# EAGLE design cv_led2 (EAGLE 8.5.2)
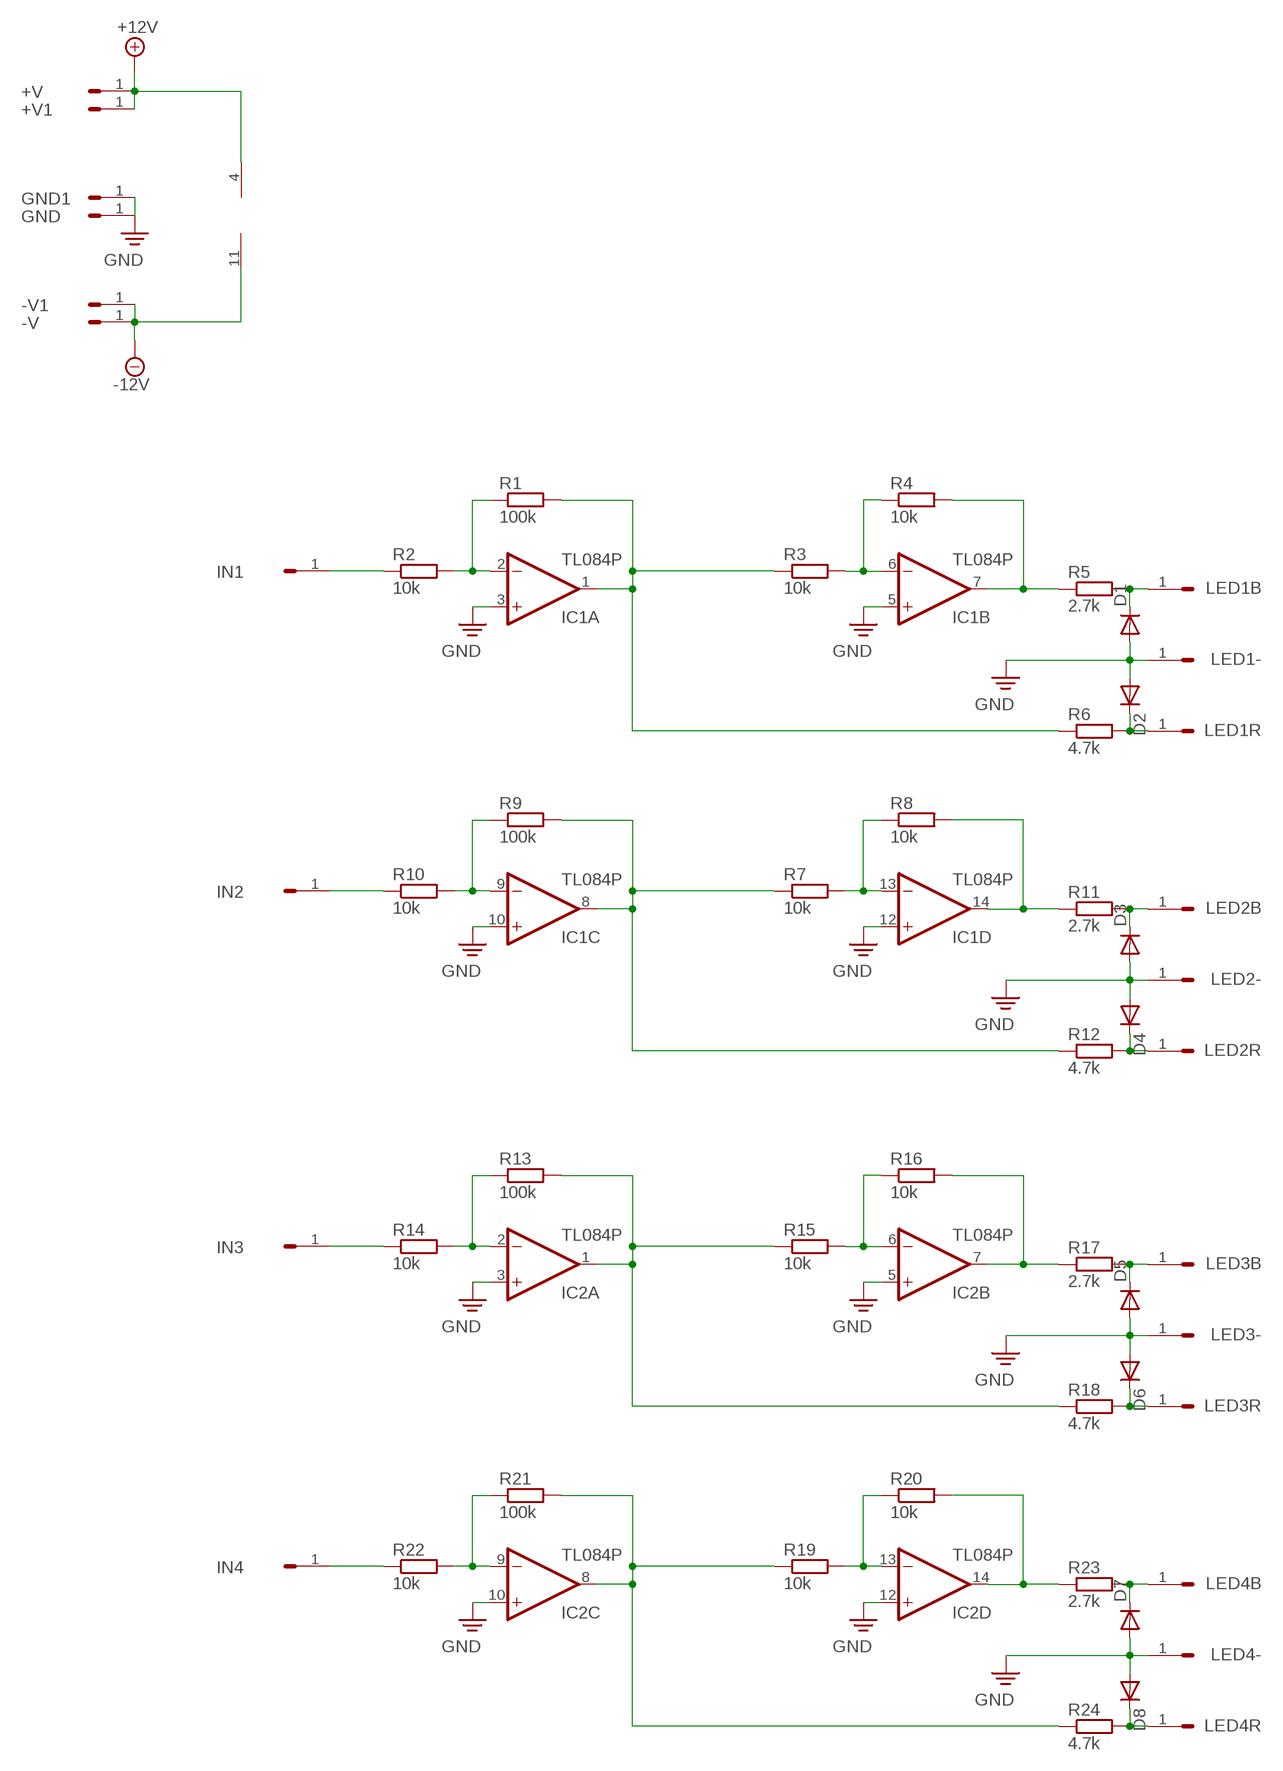
[diagram p0: schematic, sheet 1]

## Parts
+V  HEADER/MALE/01  [HEADER/MALE/01]
+V1  HEADER/MALE/01  [HEADER/MALE/01]
-V  HEADER/MALE/01  [HEADER/MALE/01]
-V1  HEADER/MALE/01  [HEADER/MALE/01]
D1  1N4148DO35-7  [DO35-7]
D2  1N4148DO35-7  [DO35-7]
D3  1N4148DO35-7  [DO35-7]
D4  1N4148DO35-7  [DO35-7]
D5  1N4148DO35-7  [DO35-7]
D6  1N4148DO35-7  [DO35-7]
D7  1N4148DO35-7  [DO35-7]
D8  1N4148DO35-7  [DO35-7]
GND  HEADER/MALE/01  [HEADER/MALE/01]
GND1  HEADER/MALE/01  [HEADER/MALE/01]
IC1  TL084P  [DIL14]
IC2  TL084P  [DIL14]
IN1  HEADER/MALE/01  [HEADER/MALE/01]
IN2  HEADER/MALE/01  [HEADER/MALE/01]
IN3  HEADER/MALE/01  [HEADER/MALE/01]
IN4  HEADER/MALE/01  [HEADER/MALE/01]
LED1-  HEADER/MALE/01  [HEADER/MALE/01]
LED1B  HEADER/MALE/01  [HEADER/MALE/01]
LED1R  HEADER/MALE/01  [HEADER/MALE/01]
LED2-  HEADER/MALE/01  [HEADER/MALE/01]
LED2B  HEADER/MALE/01  [HEADER/MALE/01]
LED2R  HEADER/MALE/01  [HEADER/MALE/01]
LED3-  HEADER/MALE/01  [HEADER/MALE/01]
LED3B  HEADER/MALE/01  [HEADER/MALE/01]
LED3R  HEADER/MALE/01  [HEADER/MALE/01]
LED4-  HEADER/MALE/01  [HEADER/MALE/01]
LED4B  HEADER/MALE/01  [HEADER/MALE/01]
LED4R  HEADER/MALE/01  [HEADER/MALE/01]
R1  100k  RESISTORRESISTOR/UPRIGHT/7.5  [RESISTOR/7.5]
R2  10k  RESISTORRESISTOR/UPRIGHT/7.5  [RESISTOR/7.5]
R3  10k  RESISTORRESISTOR/UPRIGHT/7.5  [RESISTOR/7.5]
R4  10k  RESISTORRESISTOR/UPRIGHT/7.5  [RESISTOR/7.5]
R5  2.7k  RESISTORRESISTOR/UPRIGHT/7.5  [RESISTOR/7.5]
R6  4.7k  RESISTORRESISTOR/UPRIGHT/7.5  [RESISTOR/7.5]
R7  10k  RESISTORRESISTOR/UPRIGHT/7.5  [RESISTOR/7.5]
R8  10k  RESISTORRESISTOR/UPRIGHT/7.5  [RESISTOR/7.5]
R9  100k  RESISTORRESISTOR/UPRIGHT/7.5  [RESISTOR/7.5]
R10  10k  RESISTORRESISTOR/UPRIGHT/7.5  [RESISTOR/7.5]
R11  2.7k  RESISTORRESISTOR/UPRIGHT/7.5  [RESISTOR/7.5]
R12  4.7k  RESISTORRESISTOR/UPRIGHT/7.5  [RESISTOR/7.5]
R13  100k  RESISTORRESISTOR/UPRIGHT/7.5  [RESISTOR/7.5]
R14  10k  RESISTORRESISTOR/UPRIGHT/7.5  [RESISTOR/7.5]
R15  10k  RESISTORRESISTOR/UPRIGHT/7.5  [RESISTOR/7.5]
R16  10k  RESISTORRESISTOR/UPRIGHT/7.5  [RESISTOR/7.5]
R17  2.7k  RESISTORRESISTOR/UPRIGHT/7.5  [RESISTOR/7.5]
R18  4.7k  RESISTORRESISTOR/UPRIGHT/7.5  [RESISTOR/7.5]
R19  10k  RESISTORRESISTOR/UPRIGHT/7.5  [RESISTOR/7.5]
R20  10k  RESISTORRESISTOR/UPRIGHT/7.5  [RESISTOR/7.5]
R21  100k  RESISTORRESISTOR/UPRIGHT/7.5  [RESISTOR/7.5]
R22  10k  RESISTORRESISTOR/UPRIGHT/7.5  [RESISTOR/7.5]
R23  2.7k  RESISTORRESISTOR/UPRIGHT/7.5  [RESISTOR/7.5]
R24  4.7k  RESISTORRESISTOR/UPRIGHT/7.5  [RESISTOR/7.5]

## Nets
+12V: +V1.1 +V.1 IC1.4(P:V+)
-12V: -V1.1 -V.1 IC1.11(P:V-)
GND: D1.A D2.A D3.A D4.A D5.A D6.A D7.A D8.A GND1.1 GND.1 IC1.3(A:+IN) IC1.5(B:+IN) IC1.10(C:+IN) IC1.12(D:+IN) IC2.3(A:+IN) IC2.5(B:+IN) IC2.10(C:+IN) IC2.12(D:+IN) LED1-.1 LED2-.1 LED3-.1 LED4-.1
N$1: IC1.6(B:-IN) R3.2 R4.1
N$2: IC1.2(A:-IN) R1.1 R2.2
N$3: IC1.1(A:OUT) R1.2 R3.1 R6.1
N$4: IN1.1 R2.1
N$5: IC1.7(B:OUT) R4.2 R5.1
N$6: D1.C LED1B.1 R5.2
N$7: D2.C LED1R.1 R6.2
N$8: IC1.13(D:-IN) R7.2 R8.1
N$9: IC1.9(C:-IN) R9.1 R10.2
N$10: IN2.1 R10.1
N$11: IC1.14(D:OUT) R8.2 R11.1
N$12: IC1.8(C:OUT) R7.1 R9.2 R12.1
N$13: IC2.2(A:-IN) R13.1 R14.2
N$14: D3.C LED2B.1 R11.2
N$15: D4.C LED2R.1 R12.2
N$16: IC2.1(A:OUT) R13.2 R15.1 R18.1
N$17: IC2.6(B:-IN) R15.2 R16.1
N$18: IN3.1 R14.1
N$19: IC2.7(B:OUT) R16.2 R17.1
N$20: D5.C LED3B.1 R17.2
N$21: D6.C LED3R.1 R18.2
N$22: IC2.13(D:-IN) R19.2 R20.1
N$23: IC2.9(C:-IN) R21.1 R22.2
N$24: IC2.14(D:OUT) R20.2 R23.1
N$25: IC2.8(C:OUT) R19.1 R21.2 R24.1
N$26: D7.C LED4B.1 R23.2
N$27: D8.C LED4R.1 R24.2
N$28: IN4.1 R22.1

## Power pins joined to a net without a drawn wire
V+: IC2.4(P:V+)
V-: IC2.11(P:V-)

## Library data of the parts
+V +V1 -V -V1 GND GND1 IN1-IN4 LED1- LED1B LED1R LED2- LED2B LED2R LED3- LED3B LED3R LED4- LED4B LED4R = connectors:HEADER/MALE/01; SPICEPREFIX: X
D1-D8 = transistors:1N4148: DIODE high speed (Philips)
IC1 IC2 = ic_analogue:TL084: OP AMP
R1-R24 = resistors:RESISTOR: RESISTOR, European symbol

## Board
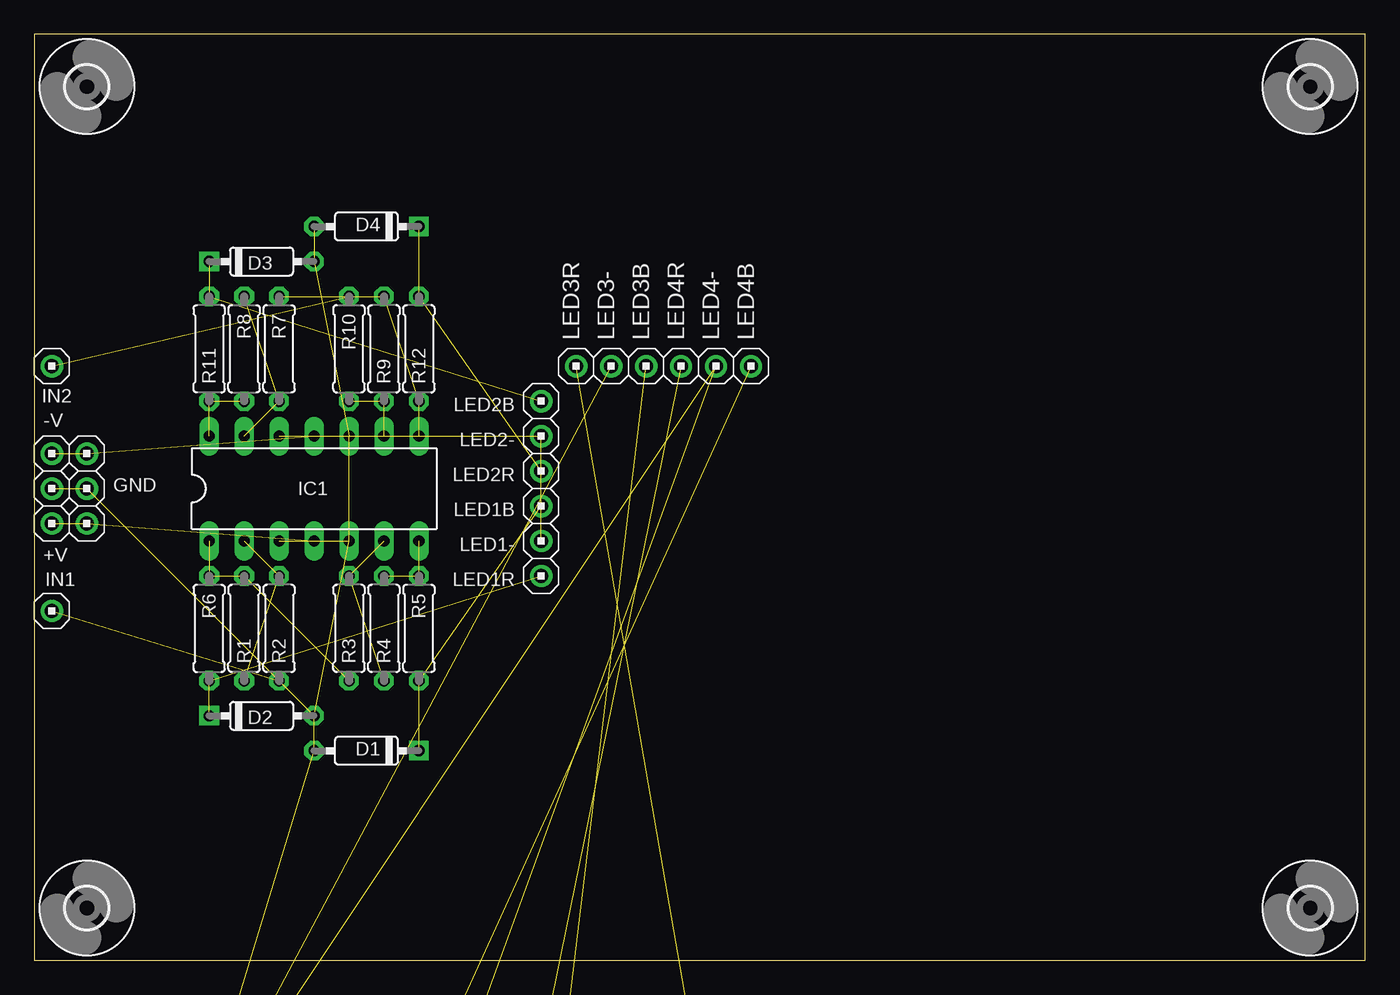
[diagram p1: board, top side]
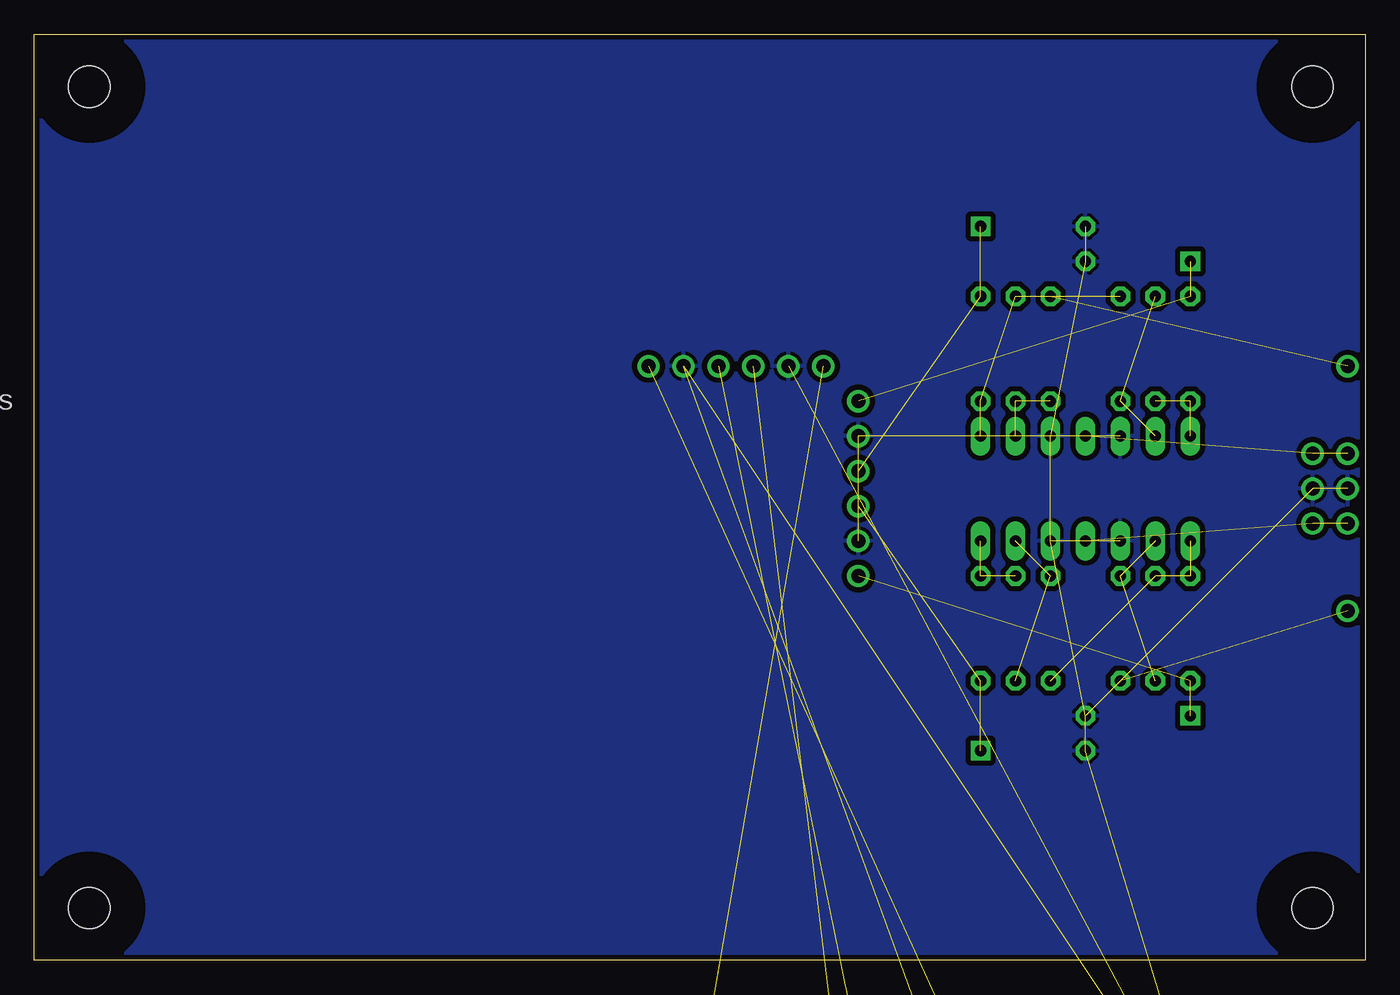
[diagram p2: board, bottom side, seen from below]

Size 96.7 x 67.3 mm. Coordinates in mm from the lower left corner, seen from the top.
Outline: 0,0 96.7,0 96.7,67.3 0,67.3 0,0
Copper layers (1*16): Top 0.0356mm / dielectric 1.5011mm / Bottom 0.0356mm
Design rules "pigatron": minimum track width 12mil, minimum drill 13mil, track to track 15mil, track to pad 10mil, pad to pad 10mil, via to via 10mil, smd to smd 6mil, copper to edge 15mil, drill to drill 10mil, minimum pad ring 12mil, minimum via ring 10mil, stop-mask expansion 4mil, vias tented up to drill 0mil, thermal gap 10mil

### Footprints (pad centres in the part's own frame; a part is rotated, then mirrored left to right if it is on the bottom)
HEADER/MALE/01 = drill 1.016: 1 0,0
DO35-7 = drill 0.813 octagon: A 3.81,0 | drill 0.813 square: C -3.81,0
DIL14 = drill 0.813 long: 1 -7.62,-3.81; 2 -5.08,-3.81; 3 -2.54,-3.81; 4 0,-3.81; 5 2.54,-3.81; 6 5.08,-3.81; 7 7.62,-3.81; 8 7.62,3.81; 9 5.08,3.81; 10 2.54,3.81; 11 0,3.81; 12 -2.54,3.81; 13 -5.08,3.81; 14 -7.62,3.81
RESISTOR/7.5 = drill 0.813 octagon: 1 -3.81,0; 2 3.81,0
STANDOFF/3.0 = hole 3: 0,0

### Placement (x,y rotation side)
+V  1.27,31.75 0 top
+V1  3.81,31.75 0 top
-V  1.27,36.83 0 top
-V1  3.81,36.83 0 top
D1  24.13,15.24 180 top
D2  16.51,17.78 0 top
D3  16.51,50.8 0 top
D4  24.13,53.34 180 top
D5  36.83,-52.07 0 top  (outside the outline)
D6  59.69,-52.07 0 top  (outside the outline)
D7  5.08,-68.58 0 top  (outside the outline)
D8  27.94,-68.58 0 top  (outside the outline)
GND  1.27,34.29 0 top
GND1  3.81,34.29 0 top
IC1  20.32,34.29 0 top
IC2  8.89,-17.78 0 top  (outside the outline)
IN1  1.27,25.4 0 top
IN2  1.27,43.18 0 top
IN3  54.61,-36.83 0 top  (outside the outline)
IN4  71.12,-36.83 0 top  (outside the outline)
LED1-  36.83,30.48 180 top
LED1B  36.83,33.02 180 top
LED1R  36.83,27.94 180 top
LED2-  36.83,38.1 180 top
LED2B  36.83,40.64 180 top
LED2R  36.83,35.56 180 top
LED3-  41.91,43.18 90 top
LED3B  44.45,43.18 90 top
LED3R  39.37,43.18 90 top
LED4-  49.53,43.18 90 top
LED4B  52.07,43.18 90 top
LED4R  46.99,43.18 90 top
R1  15.24,24.13 90 top
R2  17.78,24.13 90 top
R3  22.86,24.13 90 top
R4  25.4,24.13 90 top
R5  27.94,24.13 270 top
R6  12.7,24.13 270 top
R7  17.78,44.45 270 top
R8  15.24,44.45 270 top
R9  25.4,44.45 90 top
R10  22.86,44.45 270 top
R11  12.7,44.45 90 top
R12  27.94,44.45 90 top
R13  50.8,-68.58 0 top  (outside the outline)
R14  73.66,-68.58 0 top  (outside the outline)
R15  5.08,-83.82 0 top  (outside the outline)
R16  27.94,-83.82 0 top  (outside the outline)
R17  50.8,-83.82 0 top  (outside the outline)
R18  73.66,-83.82 0 top  (outside the outline)
R19  5.08,-99.06 0 top  (outside the outline)
R20  27.94,-99.06 0 top  (outside the outline)
R21  50.8,-99.06 0 top  (outside the outline)
R22  73.66,-99.06 0 top  (outside the outline)
R23  5.08,-114.3 0 top  (outside the outline)
R24  27.94,-114.3 0 top  (outside the outline)
U$1  [STANDOFF/3.0]  3.81,3.81 0 top
U$2  [STANDOFF/3.0]  3.81,63.5 0 top
U$3  [PIGATRON-LOGO]  105.41,41.91 0 bottom  (outside the outline)
U$4  [STANDOFF/3.0]  92.71,3.81 0 top
U$5  [STANDOFF/3.0]  92.71,63.5 0 top

### Tracks (layer width: path | path; a pad name or v marks a point on that pad's centre or on a via)
+12V  (2 unrouted)
-12V  (2 unrouted)
GND  (21 unrouted)
  pour Bottom: 0,67.31 0,0 96.52,0 96.52,67.31
N$1  (2 unrouted)
N$2  (2 unrouted)
N$3  (3 unrouted)
N$4  (1 unrouted)
N$5  (2 unrouted)
N$6  (2 unrouted)
N$7  (2 unrouted)
N$8  (2 unrouted)
N$9  (2 unrouted)
N$10  (1 unrouted)
N$11  (2 unrouted)
N$12  (3 unrouted)
N$13  (2 unrouted)
N$14  (2 unrouted)
N$15  (2 unrouted)
N$16  (3 unrouted)
N$17  (2 unrouted)
N$18  (1 unrouted)
N$19  (2 unrouted)
N$20  (2 unrouted)
N$21  (2 unrouted)
N$22  (2 unrouted)
N$23  (2 unrouted)
N$24  (2 unrouted)
N$25  (3 unrouted)
N$26  (2 unrouted)
N$27  (2 unrouted)
N$28  (1 unrouted)

### Text on the board
tNames: CV_LED